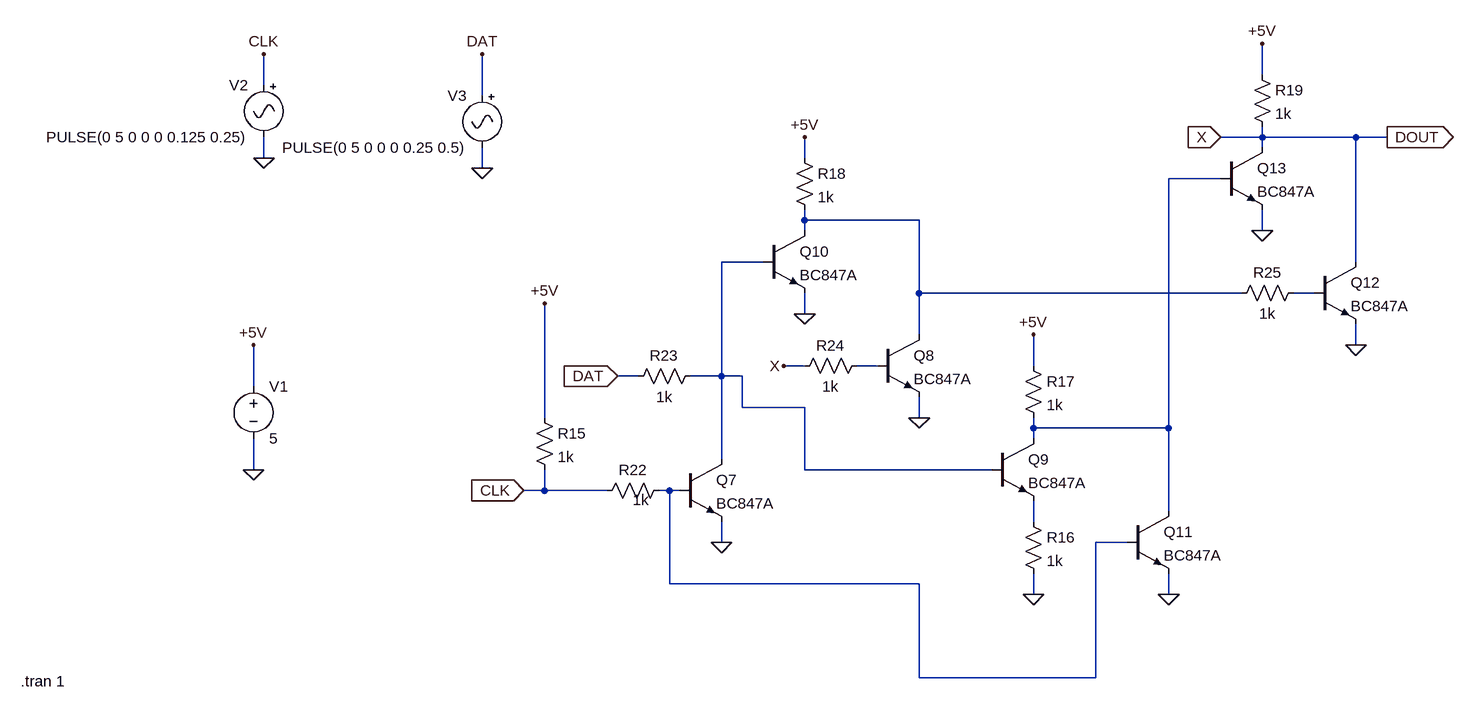
[diagram p0: schematic FlipFlop-Instr.asc]
FlipFlop-Instr.asc, the LTspice schematic file:
Version 4
SHEET 1 1440 1768
WIRE 800 816 800 768
WIRE -736 832 -736 784
WIRE -400 848 -400 784
WIRE 800 912 800 896
WIRE 800 912 736 912
WIRE 944 912 800 912
WIRE 992 912 944 912
WIRE 800 928 800 912
WIRE -736 944 -736 912
WIRE 96 944 96 912
WIRE -400 960 -400 928
WIRE 736 976 656 976
WIRE 96 1040 96 1024
WIRE 272 1040 96 1040
WIRE 96 1056 96 1040
WIRE 800 1056 800 1024
WIRE 32 1104 -32 1104
WIRE 944 1104 944 912
WIRE 272 1152 272 1040
WIRE 768 1152 272 1152
WIRE 880 1152 848 1152
WIRE 96 1184 96 1152
WIRE 272 1216 272 1152
WIRE 944 1232 944 1200
WIRE 96 1264 64 1264
WIRE 208 1264 176 1264
WIRE 448 1264 448 1216
WIRE -160 1280 -192 1280
WIRE -32 1280 -32 1104
WIRE -32 1280 -80 1280
WIRE 0 1280 -32 1280
WIRE -752 1296 -752 1232
WIRE 0 1328 0 1280
WIRE 96 1328 0 1328
WIRE -304 1344 -304 1168
WIRE 272 1344 272 1312
WIRE 448 1360 448 1344
WIRE 656 1360 656 976
WIRE 656 1360 448 1360
WIRE 448 1376 448 1360
WIRE -32 1408 -32 1280
WIRE -752 1424 -752 1376
WIRE 96 1424 96 1328
WIRE 384 1424 96 1424
WIRE -304 1456 -304 1424
WIRE -304 1456 -336 1456
WIRE -208 1456 -304 1456
WIRE -112 1456 -128 1456
WIRE -96 1456 -112 1456
WIRE 656 1488 656 1360
WIRE 448 1504 448 1472
WIRE -32 1536 -32 1504
WIRE 592 1536 544 1536
WIRE -112 1600 -112 1456
WIRE 272 1600 -112 1600
WIRE 448 1616 448 1584
WIRE 656 1616 656 1584
WIRE 272 1744 272 1600
WIRE 544 1744 544 1536
WIRE 544 1744 272 1744
FLAG -304 1168 +5V
FLAG -336 1456 CLK
IOPIN -336 1456 In
FLAG -192 1280 DAT
IOPIN -192 1280 In
FLAG 96 912 +5V
FLAG 96 1184 0
FLAG 272 1344 0
FLAG 64 1264 X
FLAG -32 1536 0
FLAG 448 1616 0
FLAG 448 1216 +5V
FLAG 656 1616 0
FLAG 800 1056 0
FLAG 800 768 +5V
FLAG 736 912 X
IOPIN 736 912 In
FLAG 944 1232 0
FLAG -752 1424 0
FLAG -752 1232 +5V
FLAG -400 960 0
FLAG -736 944 0
FLAG -736 784 CLK
FLAG -400 784 DAT
FLAG 992 912 DOUT
IOPIN 992 912 Out
SYMBOL voltage -752 1280 R0
WINDOW 123 0 0 Left 2
WINDOW 39 0 0 Left 2
SYMATTR InstName V1
SYMATTR Value 5
SYMBOL Misc\\signal -736 816 M0
WINDOW 123 0 0 Left 2
WINDOW 39 0 0 Left 2
SYMATTR InstName V2
SYMATTR Value PULSE(0 5 0 0 0 0.125 0.25)
SYMBOL Misc\\signal -400 832 M0
WINDOW 123 0 0 Left 2
WINDOW 39 0 0 Left 2
SYMATTR InstName V3
SYMATTR Value PULSE(0 5 0 0 0 0.25 0.5)
SYMBOL npn -96 1408 R0
SYMATTR InstName Q7
SYMATTR Value BC847A
SYMBOL npn 208 1216 R0
SYMATTR InstName Q8
SYMATTR Value BC847A
SYMBOL npn 384 1376 R0
SYMATTR InstName Q9
SYMATTR Value BC847A
SYMBOL npn 32 1056 R0
SYMATTR InstName Q10
SYMATTR Value BC847A
SYMBOL npn 592 1488 R0
SYMATTR InstName Q11
SYMATTR Value BC847A
SYMBOL npn 880 1104 R0
SYMATTR InstName Q12
SYMATTR Value BC847A
SYMBOL res -320 1328 R0
SYMATTR InstName R15
SYMATTR Value 1k
SYMBOL res 432 1488 R0
SYMATTR InstName R16
SYMATTR Value 1k
SYMBOL res 432 1248 R0
SYMATTR InstName R17
SYMATTR Value 1k
SYMBOL res 80 928 R0
SYMATTR InstName R18
SYMATTR Value 1k
SYMBOL res 784 800 R0
SYMATTR InstName R19
SYMATTR Value 1k
SYMBOL res -112 1440 R90
WINDOW 0 0 56 VBottom 2
WINDOW 3 15 44 VTop 2
SYMATTR InstName R22
SYMATTR Value 1k
SYMATTR SpiceLine tol=5
SYMBOL res -64 1264 R90
WINDOW 0 0 56 VBottom 2
WINDOW 3 32 56 VTop 2
SYMATTR InstName R23
SYMATTR Value 1k
SYMATTR SpiceLine tol=5
SYMBOL res 192 1248 R90
WINDOW 0 0 56 VBottom 2
WINDOW 3 32 56 VTop 2
SYMATTR InstName R24
SYMATTR Value 1k
SYMBOL res 864 1136 R90
WINDOW 0 0 56 VBottom 2
WINDOW 3 32 56 VTop 2
SYMATTR InstName R25
SYMATTR Value 1k
SYMBOL npn 736 928 R0
SYMATTR InstName Q13
SYMATTR Value BC847A
TEXT -1110 1750 Left 2 !.tran 1

The netlist it stands for:
* FlipFlop-Instr.asc
V1 +5V 0 5
V2 CLK 0 PULSE(0 5 0 0 0 0.125 0.25)
V3 DAT 0 PULSE(0 5 0 0 0 0.25 0.5)
Q7 N003 N006 0 0 BC847A
Q8 N002 N005 0 0 BC847A
Q9 N001 N003 N007 0 BC847A
Q10 N002 N003 0 0 BC847A
Q11 N001 N006 0 0 BC847A
Q12 DOUT N004 0 0 BC847A
R15 +5V CLK 1k
R16 N007 0 1k
R17 +5V N001 1k
R18 +5V N002 1k
R19 +5V DOUT 1k
R22 N006 CLK 1k tol=5
R23 N003 DAT 1k tol=5
R24 N005 DOUT 1k
R25 N004 N002 1k
Q13 DOUT N001 0 0 BC847A
.model NPN NPN
.model PNP PNP
.lib standard.bjt
.tran 1
.backanno
.end